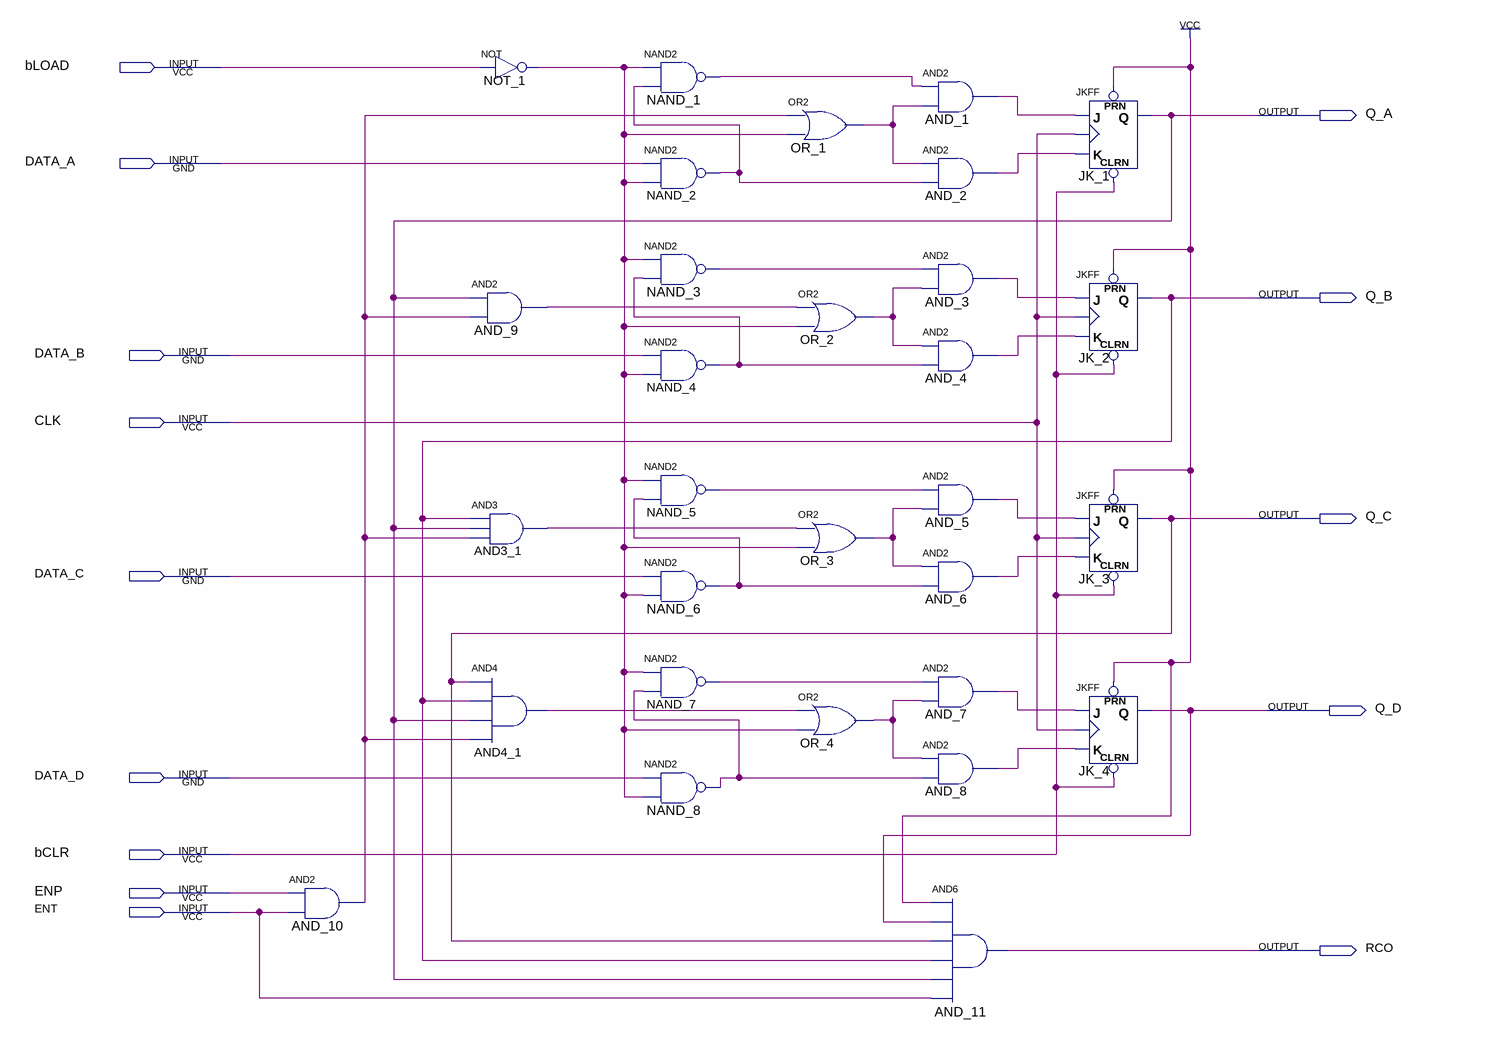
[diagram p0: schematic sheet]
// Quartus schematic IC_74LS161_RTL.bdf as structural Verilog: 30 symbols, 14 pins
module IC_74LS161_RTL (
  input  bLOAD,
  input  DATA_A,
  input  DATA_B,
  input  CLK,
  input  DATA_C,
  input  DATA_D,
  input  bCLR,
  input  ENP,
  input  ENT,
  output Q_A,
  output Q_B,
  output Q_C,
  output Q_D,
  output RCO
);

  wire AND3_1_out, AND4_1_out, AND_1_out, AND_2_out, AND_3_out, AND_4_out, AND_5_out, AND_6_out, AND_7_out,
       AND_8_out, AND_9_out, AND_10_out, NAND_1_out, NAND_2_out, NAND_3_out, NAND_4_out, NAND_5_out,
       NAND_6_out, NAND_7_out, NAND_8_out, NOT_1_out, OR_1_out, OR_2_out, OR_3_out, OR_4_out;

  and AND_10 (AND_10_out, ENP, ENT);
  not NOT_1 (NOT_1_out, bLOAD);
  and AND_9 (AND_9_out, Q_A, AND_10_out);
  and AND3_1 (AND3_1_out, Q_B, Q_A, AND_10_out);
  and AND4_1 (AND4_1_out, Q_C, Q_B, Q_A, AND_10_out);
  nand NAND_1 (NAND_1_out, NOT_1_out, NAND_2_out);
  nand NAND_2 (NAND_2_out, DATA_A, NOT_1_out);
  nand NAND_3 (NAND_3_out, NOT_1_out, NAND_4_out);
  nand NAND_4 (NAND_4_out, DATA_B, NOT_1_out);
  nand NAND_5 (NAND_5_out, NOT_1_out, NAND_6_out);
  nand NAND_6 (NAND_6_out, DATA_C, NOT_1_out);
  nand NAND_7 (NAND_7_out, NOT_1_out, NAND_8_out);
  nand NAND_8 (NAND_8_out, DATA_D, NOT_1_out);
  or OR_1 (OR_1_out, AND_10_out, NOT_1_out);
  or OR_2 (OR_2_out, AND_9_out, NOT_1_out);
  or OR_3 (OR_3_out, AND3_1_out, NOT_1_out);
  or OR_4 (OR_4_out, AND4_1_out, NOT_1_out);
  and AND_1 (AND_1_out, NAND_1_out, OR_1_out);
  and AND_2 (AND_2_out, OR_1_out, NAND_2_out);
  and AND_3 (AND_3_out, NAND_3_out, OR_2_out);
  and AND_4 (AND_4_out, OR_2_out, NAND_4_out);
  and AND_5 (AND_5_out, NAND_5_out, OR_3_out);
  and AND_6 (AND_6_out, OR_3_out, NAND_6_out);
  and AND_7 (AND_7_out, NAND_7_out, OR_4_out);
  and AND_8 (AND_8_out, OR_4_out, NAND_8_out);
  and AND_11 (RCO, 1'b1, Q_D, Q_C, Q_B, Q_A, ENT);
  JKFF JK_1 (.PRN(1'b1), .CLRN(bCLR), .K(AND_2_out), .J(AND_1_out), .CLK(CLK), .Q(Q_A));
  JKFF JK_2 (.PRN(1'b1), .CLRN(bCLR), .K(AND_4_out), .J(AND_3_out), .CLK(CLK), .Q(Q_B));
  JKFF JK_3 (.PRN(1'b1), .CLRN(bCLR), .K(AND_6_out), .J(AND_5_out), .CLK(CLK), .Q(Q_C));
  JKFF JK_4 (.PRN(1'b1), .CLRN(bCLR), .K(AND_8_out), .J(AND_7_out), .CLK(CLK), .Q(Q_D));
endmodule
